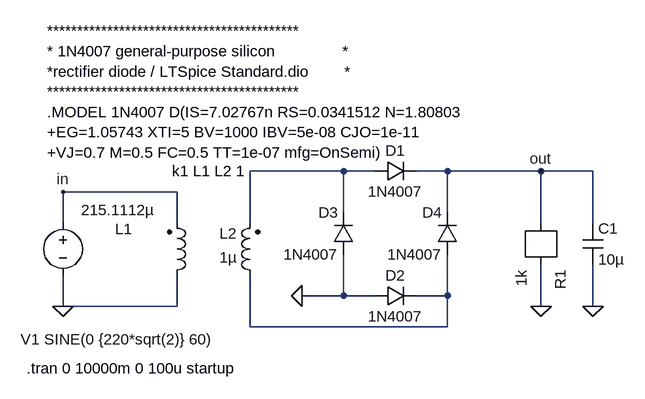
[diagram p0: schematic lab2_ex2.asc]
lab2_ex2.asc, the LTspice schematic file:
Version 4
SHEET 1 936 680
WIRE 448 304 304 304
WIRE 496 304 448 304
WIRE 608 304 560 304
WIRE 752 304 608 304
WIRE 832 304 752 304
WIRE 192 336 16 336
WIRE 448 368 448 304
WIRE 608 368 608 304
WIRE 16 384 16 336
WIRE 192 384 192 336
WIRE 304 384 304 304
WIRE 752 384 752 304
WIRE 832 384 832 304
WIRE 448 496 448 432
WIRE 448 496 384 496
WIRE 496 496 448 496
WIRE 608 496 608 432
WIRE 608 496 560 496
WIRE 16 512 16 464
WIRE 192 512 192 464
WIRE 192 512 16 512
WIRE 752 512 752 448
WIRE 832 512 832 448
WIRE 304 544 304 464
WIRE 608 544 608 496
WIRE 608 544 304 544
FLAG 752 512 0
FLAG 16 336 in
FLAG 752 304 out
FLAG 16 512 0
FLAG 384 496 0
FLAG 832 512 0
SYMBOL voltage 16 368 R0
WINDOW 0 -65 195 Left 2
WINDOW 3 -29 195 Left 2
SYMATTR InstName V1
SYMATTR Value SINE(0 {220*sqrt(2)} 60)
SYMBOL r 752 384 R90
SYMATTR InstName R1
SYMATTR Value 1k
SYMBOL ind2 176 480 M180
WINDOW 0 -80 87 Left 2
WINDOW 3 -132 116 Left 2
SYMATTR InstName L1
SYMATTR Value 215.1112µ
SYMATTR Type ind
SYMATTR SpiceLine Rser=1m
SYMBOL ind2 320 480 R180
WINDOW 0 36 80 Left 2
WINDOW 3 36 43 Left 2
SYMATTR InstName L2
SYMATTR Value 1µ
SYMATTR Type ind
SYMATTR SpiceLine Rser=0
SYMBOL diode 496 320 R270
WINDOW 0 32 32 VTop 2
WINDOW 3 0 32 VBottom 2
SYMATTR InstName D1
SYMATTR Value 1N4007
SYMBOL diode 496 512 R270
WINDOW 0 32 32 VTop 2
WINDOW 3 0 32 VBottom 2
SYMATTR InstName D2
SYMATTR Value 1N4007
SYMBOL diode 464 432 R180
WINDOW 0 24 64 Left 2
WINDOW 3 24 0 Left 2
SYMATTR InstName D3
SYMATTR Value 1N4007
SYMBOL diode 624 432 R180
WINDOW 0 24 64 Left 2
WINDOW 3 24 0 Left 2
SYMATTR InstName D4
SYMATTR Value 1N4007
SYMBOL cap 816 384 R0
SYMATTR InstName C1
SYMATTR Value 10µ
TEXT -8 88 Left 2 !******************************************\n* 1N4007 general-purpose silicon       		*\n*rectifier diode / LTSpice Standard.dio		*\n******************************************\n.MODEL 1N4007 D(IS=7.02767n RS=0.0341512 N=1.80803 \n+EG=1.05743 XTI=5 BV=1000 IBV=5e-08 CJO=1e-11 \n+VJ=0.7 M=0.5 FC=0.5 TT=1e-07 mfg=OnSemi)
TEXT 184 304 Left 2 !k1 L1 L2 1
TEXT -40 608 Left 2 !.tran 0 10000m 0 100u startup

The netlist it stands for:
* lab2_ex2.asc
V1 in 0 SINE(0 {220*sqrt(2)} 60)
R1 0 out 1k
L1 0 in 215.1112µ Rser=1m
L2 N002 N001 1µ Rser=0
D1 N001 out 1N4007
D2 0 N002 1N4007
D3 0 N001 1N4007
D4 N002 out 1N4007
C1 out 0 10µ
.model D D
.lib standard.dio
******************************************
* 1N4007 general-purpose silicon       		*
*rectifier diode / LTSpice Standard.dio		*
******************************************
.MODEL 1N4007 D(IS=7.02767n RS=0.0341512 N=1.80803
+EG=1.05743 XTI=5 BV=1000 IBV=5e-08 CJO=1e-11
+VJ=0.7 M=0.5 FC=0.5 TT=1e-07 mfg=OnSemi)
k1 L1 L2 1
.tran 0 10000m 0 100u startup
.backanno
.end